# EAGLE design shield-microsd (EAGLE 5.06)
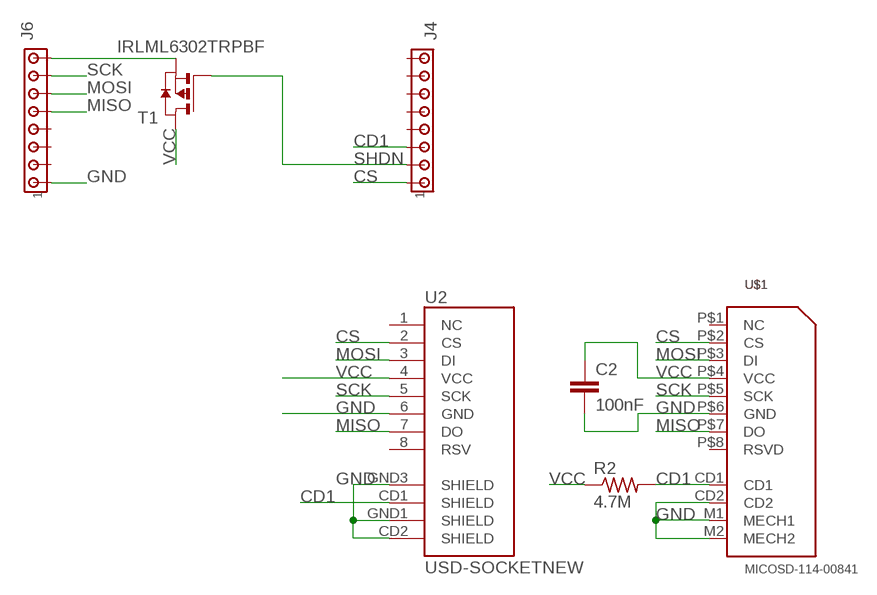
[diagram p0: schematic, sheet 1]

## Parts
C2  100nF  C-EUC0805  [C0805]
J4  MTA08-100  [10X08MTA]
J6  MTA08-100  [10X08MTA]
R2  4.7M  R-US_R0805  [R0805]
T1  IRLML6302TRPBF  PMOSSOT23  [SOT-23]
U2  USD-SOCKETNEW  [MICRO-SD-SOCKET-PP]
U$1  MICOSD-114-00841  [MICROSD_AMP_114-00841-68]

## Nets
CD1: J4.3 R2.2 U2.CD1(SHIELD) U$1.CD1
CS: J4.1 U2.2(CS) U$1.P$2(CS)
GND: C2.2 J6.1 U2.6(GND) U2.CD2(SHIELD) U2.GND1(SHIELD) U2.GND3(SHIELD) U$1.CD2 U$1.M1(MECH1) U$1.M2(MECH2) U$1.P$6(GND)
MISO: J6.5 U2.7(DO) U$1.P$7(DO)
MOSI: J6.6 U2.3(DI) U$1.P$3(DI)
N$1: J6.8 T1.2(S)
SCK: J6.7 U2.5(SCK) U$1.P$5(SCK)
SHDN: J4.2 T1.3(G)
VCC: C2.1 R2.1 T1.1(D) U2.4(VCC) U$1.P$4(VCC)
Unconnected: J4.4 J4.5 J4.6 J4.7 J4.8 J6.2 J6.3 J6.4 U2.1(NC) U2.8(RSV) U$1.P$1(NC) U$1.P$8(RSVD)

## Library data of the parts
C2 = resistor:C-EU: CAPACITOR, European symbol
J4 J6 = con-amp:MTA08-100: AMP connector
R2 = rcl:R-US_: RESISTOR, American symbol
T1 = zetex:PMOSSOT23: MOS FET
U2 = SparkFun:USD-SOCKET: microSD Socket Push-push type uSD socket. Schematic element and footprint production proven. Spark Fun Electronics SKU : PRT-00127. tDoc lines correctly indicate media card edge positions when inserting (unlocked, locked, depressed).
U$1 = tim:MICOSD-114-00841: A common Amphenol MicroSD /usd/ card with easily accessible pins. 20110923 / tgipson

## Net classes
0 default: width 0.254 mm, drill 0.508 mm
1 pwr: width 0.305 mm, drill 0.508 mm, clearance 0.203 mm
4 digital: width 0.203 mm, drill 0.381 mm, clearance 0.203 mm

## Board
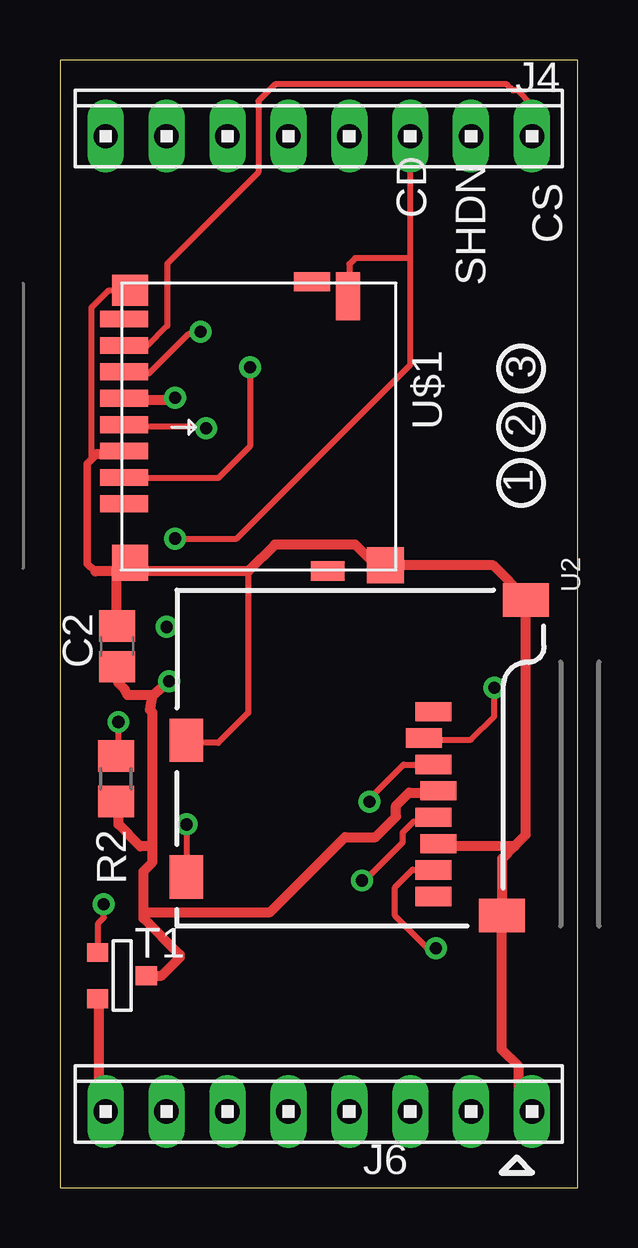
[diagram p1: board, top side]
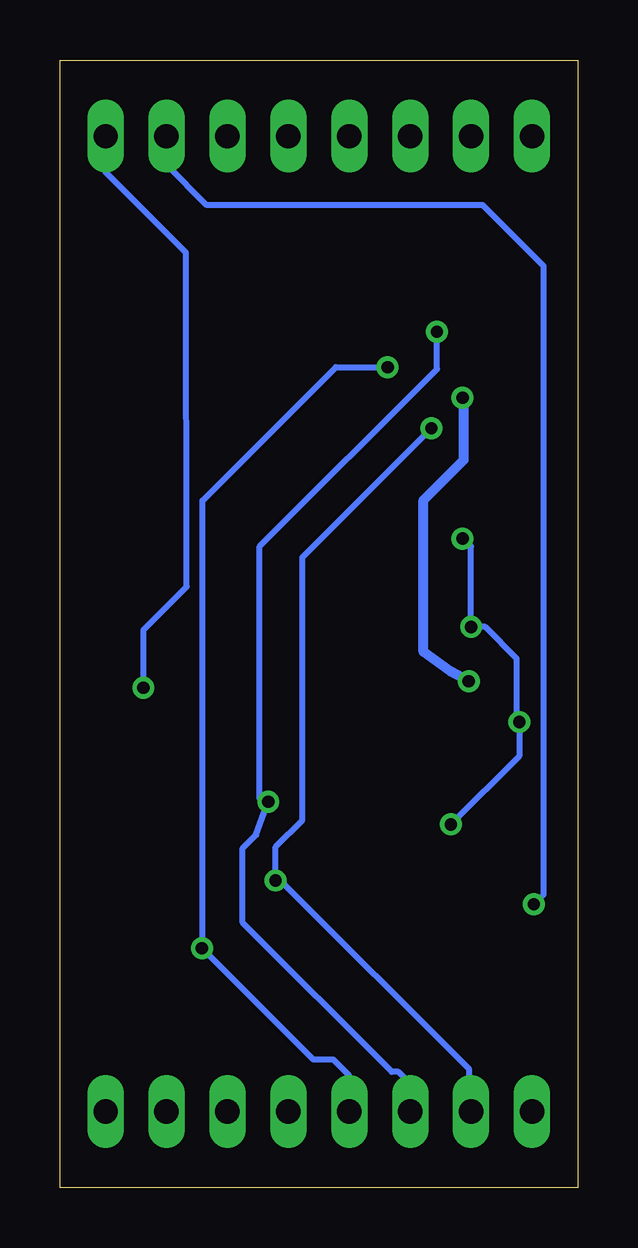
[diagram p2: board, bottom side, seen from below]

Size 21.59 x 46.99 mm. Coordinates in mm from the lower left corner, seen from the top.
Outline: 0,0 21.59,0 21.59,46.99 0,46.99 0,0
Copper layers (1*16): Top 0.035mm / dielectric 1.5mm / Bottom 0.035mm
Design rules "default *": minimum track width 8mil, minimum drill 15mil, track to track 8mil, track to pad 8mil, pad to pad 8mil, via to via 8mil, smd to smd 8mil, copper to edge 40mil, drill to drill 8mil, minimum pad ring 10mil, minimum via ring 8mil, stop-mask expansion 4mil, vias tented up to drill 0mil, thermal gap 10mil

### Footprints (pad centres in the part's own frame; a part is rotated, then mirrored left to right if it is on the bottom)
C0805 = smd 1.3 x 1.5: 1 -0.85,0; 2 0.85,0
10X08MTA = drill 1.016 long: 1 8.89,0; 2 6.35,0; 3 3.81,0; 4 1.27,0; 5 -1.27,0; 6 -3.81,0; 7 -6.35,0; 8 -8.89,0
R0805 = smd 1.3 x 1.5: 1 -0.95,0; 2 0.95,0
SOT-23 = smd 0.787 x 0.889: 1 0.025,-1.016; 2 -0.94,1.016; 3 0.991,1.016
MICRO-SD-SOCKET-PP = smd 0.8 x 1.5: 1 -8.94,10.7; 2 -7.84,10.3; 3 -6.74,10.7; 4 -5.64,10.9; 5 -4.54,10.7; 6 -3.44,10.9; 7 -2.34,10.7; 8 -1.24,10.7 | smd 1.8 x 1.4: CD1 -2.05,0.4; CD2 -7.75,0.4 | smd 1.4 x 1.9: GND1 -13.6,14.55; GND3 -0.45,13.55
MICROSD_AMP_114-00841-68 = smd 2 x 1: CD1 -0.95,9.35 | smd 1.5 x 1.55: CD2 10.265,10.9 | smd 1.3 x 1.5: M1 -1.2,0.25 | smd 1.5 x 1.5: M2 10.15,0.25 | smd 0.8 x 1.4: M3 10.5,8.5 | smd 0.8 x 1.5: M4 -1.55,7.85 | smd 0.7 x 2: P$1 0,0; P$2 1.1,0; P$3 2.2,0; P$4 3.3,0; P$5 4.4,0; P$6 5.5,0; P$7 6.6,0; P$8 7.7,0

### Placement (x,y rotation side)
C2  2.39,22.56 90 top
J4  10.79,43.81 0 top
J6  10.79,3.17 0 top
R2  2.34,17.04 90 top
T1  2.59,8.81 90 top
U2  4.88,10.9 270 top
U$1  2.67,36.2 270 top

### Tracks (layer width: path | path; a pad name or v marks a point on that pad's centre or on a via)
CD1  (via drill 0.51)
  Top 0.254: U2.CD1 5.18,13.01 5.41,13.23 5.28,13.36 v5.28,15.14 | v4.8,27.05 7.37,27.05 14.61,34.29 14.61,38.73 | v4.45,23.37 4.45,23.47 | 14.61,38.73 J4.3 | R2.2 2.44,18.09 v2.44,19.41 | U$1.CD1 12.06,37.19 12.06,38.48 12.32,38.73 14.61,38.73
  Bottom 0.254: v4.8,27.05 4.67,26.72 4.45,26.72 v4.45,23.37 3.86,23.37 2.54,22.05 2.54,19.51 v2.44,19.41 2.44,17.98 v5.28,15.14
CS  (via drill 0.51)
  Top 0.254: U2.2 15.24,18.8 15.37,18.67 17.14,18.67 18.11,19.63 v18.11,20.83 | 2.74,35.05 3.61,35.05 4.47,35.92 4.47,38.51 8.28,42.32 8.28,45.29 8.97,45.97 18.64,45.97 18.9,45.72 19.07,45.72 19.68,45.11 J4.1 | 2.74,35.05 2.64,35.05 | U$1.P$2 2.74,35.15 2.74,35.05
  Bottom 0.254: J4.1 19.68,42.32 16.33,38.96 16.31,25.04 18.11,23.24 v18.11,20.83
GND
  Top 0.254: 18.39,11.28 U2.GND3 18.39,11.38 18.44,11.43 | 16.15,14.33 15.85,14.33 U2.6 16.26,14.33 16.36,14.22 | U2.CD2 5.18,18.69 5.33,18.54 6.6,18.54 7.85,19.79 7.85,25.68 | 19.41,24.59 U2.GND1 19.41,24.38 | J6.1 19.13,3.73 | U$1.M2 2.95,26.01 2.95,25.68 | 1.93,30.58 2.64,30.58 2.64,30.68 U$1.P$6 | U$1.M1 2.85,37.39 2.03,37.39 1.32,36.68 1.32,30.48 1.38,30.42
  Top 0.305: 1.47,25.68 1.14,26.01 1.14,30.18 1.38,30.42 1.55,30.58
  Top 0.406: 19.13,3.73 19.13,5.05 18.43,5.75 U2.GND3 | 18.44,11.43 18.44,13.72 18.95,14.22 | 18.95,14.22 19.43,14.7 U2.GND1 | 18.95,14.22 16.36,14.22 | 2.34,25.68 2.95,25.68 7.85,25.68 8.97,26.8 12.32,26.8 13.19,25.93 U$1.CD2 18.06,25.93 19.41,24.59 | 2.34,25.68 1.47,25.68 | 1.55,30.58 1.93,30.58 | C2.2 2.34,23.46 2.34,25.68
MISO  (via drill 0.51)
  Top 0.254: U2.7 15.54,13.21 15.49,13.26 14.71,13.26 13.97,12.52 13.97,11.33 15.32,9.98 v15.67,9.98 | 2.74,29.57 6.6,29.57 7.92,30.89 v7.92,34.19 | 2.74,29.57 2.64,29.57 | U$1.P$7 2.74,29.67 2.74,29.57
  Bottom 0.254: J6.5 9.55,3.25 9.55,4.7 10.19,5.33 11.02,5.33 v15.67,9.98 15.65,10.01 15.65,28.63 10.08,34.19 v7.92,34.19
MOSI  (via drill 0.51)
  Top 0.254: U2.3 15.54,17.58 15.49,17.63 14.33,17.63 12.9,16.2 v12.9,16.08 | 2.74,33.93 3.71,33.93 5.33,35.56 5.77,35.56 v5.87,35.66 | 2.74,33.93 2.64,33.93 | U$1.P$3 2.74,34.04 2.74,33.93
  Bottom 0.254: 7.01,3.25 J6.6 6.93,3.23 6.93,4.29 7.47,4.83 7.75,4.83 13.97,11.05 13.97,14.15 13.41,14.71 v12.9,16.08 13.26,16.2 13.26,26.72 5.87,34.11 v5.87,35.66
N$1
  Top 0.254: 1.63,7.82 T1.2 | J6.8 1.63,3.45
  Top 0.406: 1.63,3.45 1.63,7.82
SCK  (via drill 0.51)
  Top 0.254: U2.5 15.54,15.34 15.14,15.34 15.06,15.27 14.76,15.27 14.3,14.81 14.3,14.4 12.7,12.8 v12.6,12.8 | 2.74,31.7 6.04,31.7 v6.1,31.65 | 2.74,31.7 2.64,31.7 | U$1.P$5 2.74,31.8 2.74,31.7
  Bottom 0.254: J6.7 4.47,3.25 4.52,3.3 4.52,4.93 12.39,12.8 v12.6,12.8 | v12.6,12.8 12.6,12.9 | v6.1,31.65 11.48,26.26 11.48,15.32 12.6,14.2 v12.6,12.8
SHDN  (via drill 0.51)
  Top 0.254: T1.3 1.6,9.83 1.6,11.02 1.83,11.25 v1.83,11.81
  Bottom 0.254: v1.83,11.81 1.42,12.22 1.42,38.41 3.96,40.95 15.47,40.95 17.14,42.62 J4.2
VCC  (via drill 0.51)
  Top 0.254: T1.1 3.76,8.94 | 15.75,16.46 U2.4 | v4.8,32.92 4.7,32.82 | 4.99,9.59 4.99,9.72 | U$1.P$4 2.74,32.92 2.74,32.82
  Top 0.406: 4.7,32.82 2.74,32.82 2.64,32.82 | 3.86,20.52 2.82,20.52 2.72,20.75 2.44,21.03 2.44,21.65 C2.1 | 3.86,20.52 v4.55,21.11 | 4.99,9.72 3.48,11.23 3.48,11.48 | 3.48,11.48 3.48,13.18 3.86,13.56 3.86,14.22 | 3.76,8.94 3.86,8.84 4.24,8.84 4.99,9.59 | 15.75,16.46 14.55,16.46 14.02,15.93 14.02,15.47 13.16,14.61 11.89,14.61 8.76,11.48 3.48,11.48 | 3.86,14.22 3.86,19.81 3.76,19.91 3.86,20.52 | R2.1 2.44,15.99 2.44,15.14 3.35,14.22 3.86,14.22
  Bottom 0.254: 4.75,32.87 v4.8,32.92
  Bottom 0.406: 4.75,32.87 4.75,30.33 6.43,28.65 6.43,22.33 5.31,21.51 v4.55,21.11

### Text on the board
tNames: CD | CS | SHDN | 3 | 2 | 1
Reference: Vcc | SCK | MOSI | MISO | Gnd